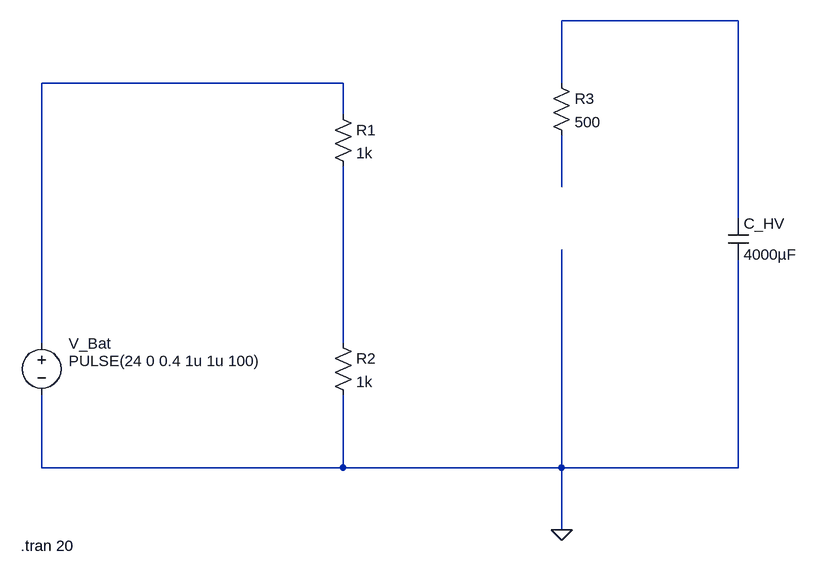
[diagram p0: schematic auto_discharge_depletion.asc]
auto_discharge_depletion.asc, the LTspice schematic file:
Version 4
SHEET 1 1944 680
WIRE 1008 -144 736 -144
WIRE 400 -48 -64 -48
WIRE 736 -48 736 -144
WIRE 400 0 400 -48
WIRE 736 112 736 32
WIRE 1008 160 1008 -144
WIRE -64 352 -64 -48
WIRE 400 352 400 80
WIRE -64 544 -64 432
WIRE 400 544 400 432
WIRE 400 544 -64 544
WIRE 736 544 736 208
WIRE 736 544 400 544
WIRE 1008 544 1008 224
WIRE 1008 544 736 544
WIRE 736 640 736 544
FLAG 736 640 0
SYMBOL voltage -64 336 R0
WINDOW 0 42 17 Left 2
WINDOW 3 42 44 Left 2
WINDOW 123 0 0 Left 0
WINDOW 39 0 0 Left 0
SYMATTR InstName V_Bat
SYMATTR Value PULSE(24 0 0.4 1u 1u 100)
SYMBOL cap 992 160 R0
SYMATTR InstName C_HV
SYMATTR Value 4000µF
SYMATTR SpiceLine IC=250
SYMBOL res 720 -64 R0
SYMATTR InstName R3
SYMATTR Value 500
SYMBOL res 384 -16 R0
SYMATTR InstName R1
SYMATTR Value 1k
SYMBOL res 384 336 R0
SYMATTR InstName R2
SYMATTR Value 1k
TEXT -96 664 Left 2 !.tran 20

The netlist it stands for:
* auto_discharge_depletion.asc
V_Bat N002 0 PULSE(24 0 0.4 1u 1u 100)
C_HV N001 0 4000µF IC=250
R3 N001 N003 500
R1 N002 N004 1k
R2 N004 0 1k
.tran 20
.backanno
.end